# Altium project Q24_ECU_V1.PrjPcb (part 3 of 3)

## Sheet 5V_TO_3V_VD.SchDoc
size A4
Used 6 times, as channels 5 Volt Signal Bulkhead/Designator, 5 Volt Signal Bulkhead/Designator, 5 Volt Signal Bulkhead/Designator, 5 Volt Signal Bulkhead/Designator, 5 Volt Signal Bulkhead/Designator, 5 Volt Signal Bulkhead/Designator. Parts and nets are listed once, with the designators drawn on the sheet.
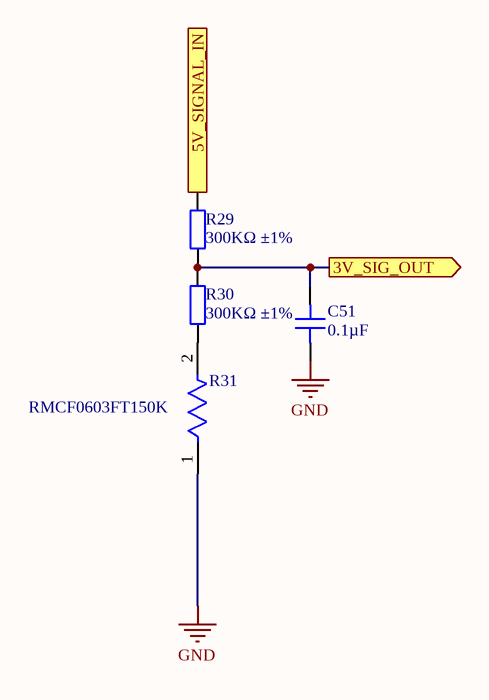
[diagram p20: 5V_TO_3V_VD.SchDoc]

### Parts
C51  0.1µF  [CAP 0402_1005]
R29  300KΩ ±1%  [0402_R]
R30  300KΩ ±1%  [0402_R]
R31  RMCF0603FT150K  [FP-RMCF0603-IPC_B]

### Ports
3V_SIG_OUT (out), 5V_SIGNAL_IN

### Nets
GND: C51.2 R31.1
3V_SIG_OUT: C51.1 R29.1 R30.2 ; port 3V_SIG_OUT
5V_SIGNAL_IN: R29.2 ; port 5V_SIGNAL_IN
NetR30_1: R30.1 R31.2

### Channels
5 Volt Signal Bulkhead/Designator: designators C51=C51_5_Volt_Signal_Bulkhead_Designator#1 R29=R29_5_Volt_Signal_Bulkhead_Designator#1 R30=R30_5_Volt_Signal_Bulkhead_Designator#1 R31=R31_Designator6; ports 3V_SIG_OUT=5-3_1 5V_SIGNAL_IN=Net4_1
5 Volt Signal Bulkhead/Designator: designators C51=C51_5_Volt_Signal_Bulkhead_Designator#2 R29=R29_5_Volt_Signal_Bulkhead_Designator#2 R30=R30_5_Volt_Signal_Bulkhead_Designator#2 R31=R31_Designator5; ports 3V_SIG_OUT=5-3_2 5V_SIGNAL_IN=Net4_2
5 Volt Signal Bulkhead/Designator: designators C51=C51_5_Volt_Signal_Bulkhead_Designator#3 R29=R29_5_Volt_Signal_Bulkhead_Designator#3 R30=R30_5_Volt_Signal_Bulkhead_Designator#3 R31=R31_Designator4; ports 3V_SIG_OUT=5-3_3 5V_SIGNAL_IN=Net4_3
5 Volt Signal Bulkhead/Designator: designators C51=C51_5_Volt_Signal_Bulkhead_Designator#4 R29=R29_5_Volt_Signal_Bulkhead_Designator#4 R30=R30_5_Volt_Signal_Bulkhead_Designator#4 R31=R31_Designator3; ports 3V_SIG_OUT=5-3_4 5V_SIGNAL_IN=Net4_4
5 Volt Signal Bulkhead/Designator: designators C51=C51_5_Volt_Signal_Bulkhead_Designator#5 R29=R29_5_Volt_Signal_Bulkhead_Designator#5 R30=R30_5_Volt_Signal_Bulkhead_Designator#5 R31=R31_Designator2; ports 3V_SIG_OUT=5-3_5 5V_SIGNAL_IN=Net4_5
5 Volt Signal Bulkhead/Designator: designators C51=C51_5_Volt_Signal_Bulkhead_Designator#6 R29=R29_5_Volt_Signal_Bulkhead_Designator#6 R30=R30_5_Volt_Signal_Bulkhead_Designator#6 R31=R31_Designator1; ports 3V_SIG_OUT=5-3_6 5V_SIGNAL_IN=Net4_6

### Library data of the parts
C51 = C0402C104K4RECAUTO: CAP CER 0402 0.1UF 16V X7R 10%; Manufacturer: KEMET; Part Number: C0402C104K4RECAUTO; Value: 0.1µF; Applications: Automotive, ESD Protection; Capacitance: 0.1µF; ComponentLink1Description: Datasheet; ComponentLink1URL: https://api.kemet.com/component-edge/download/datasheet/C0402C104K4RECAUTO.pdf; ComponentLink2Description: DigiKey Link; ComponentLink2URL: http://digikey.com/product-detail/en/kemet/C0402C104K4RECAUTO/399-17167-1-ND/8563708; Device Package: 0402 (1005 Metric); LastUpdated: 2020-09-02 1:02:25 AM; Lifecycle Status: Active; Minimum Order: 1; Mounting Type: Surface Mount, MLCC; Operating Temperature: -55°C ~ 125°C; Package / Case: 0402 (1005 Metric); Packaging: TapeAndReel; PartId: 1731; Part Status: Active; Price: 0.02; Series: ESD SMD Auto X7R; Size / Dimension: 0.039" L x 0.020" W (1.00mm x 0.50mm); Supplier 1: DigiKey; Supplier Part Number 1: 399-17167-1-ND; Temperature Coefficient: X7R; Thickness (Max): 0.022" (0.55mm); Tolerance: ±10%; Voltage - Rated: 16V; Ratings: AEC-Q200
R29 R30 = 0402 300K (3003) 1%: Chip resistor; Manufacturer: Uniroyal Elec; PartNumber: 0402WGF3003TCE; Power: 1/16W; ComponentLink1Description: Supplier link; ComponentLink1URL: http://www.szlcsc.com/product/details_26517.html; Package: 0402; Supplier: LC; SuppliersPartNumber: C25774; Resistance: 300KΩ; Tolerance: 1%
R31 = CMP-26527-003138-1: 150kΩ ±1% 0.1W 0603 Thick Film Chip Resistor AEC-Q200 compliant; Temperature Coefficient: 100ppm/°C; Max Power Dissipation: 100mW; Resistance: 150kR; Construction: Rectangular; Width: 0.031inch; Length: 0.061inch; Tolerance: 1%; Case Code (Metric): 1608; Radiation Hardening: No; Number of Terminations: 2; Case/Package: 0603; Max Operating Temperature: 155°C; Case Code (Imperial): 0603; Depth: 0.8mm; Features: Automotive AEC-Q200; RoHS Compliant: Yes; Packaging: Tape and Reel; Height: 0.022inch; Contact Plating: Tin; Series: RMCF; Military Standard: Not; Size Code: 0603; Mount: Surface Mount; Min Operating Temperature: -55°C; Power Rating: 100mW; Resistor Type: Thick Film; Lead Free: Lead Free

## Sheet Single_12V.SchDoc
size A4
Used 3 times, as channels Motor Controller 1, Motor Controller 2, Steering. Parts and nets are listed once, with the designators drawn on the sheet.
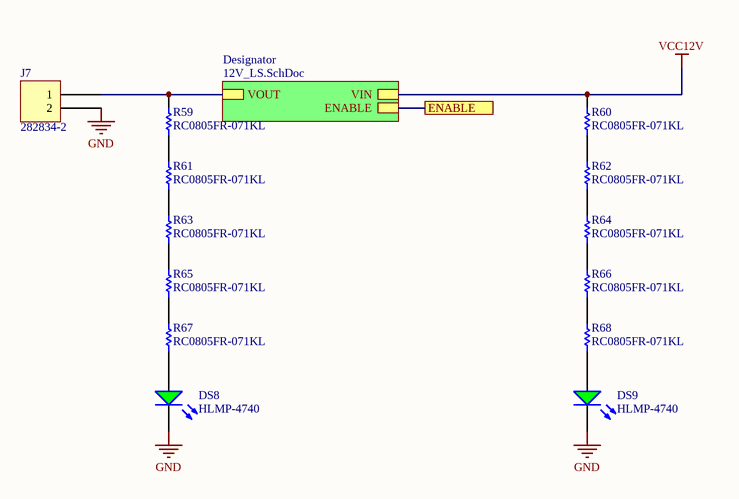
[diagram p21: Single_12V.SchDoc]

### Parts
DS8  HLMP-4740  [AVAG-HLMP-4740]
DS9  HLMP-4740  [AVAG-HLMP-4740]
J7  282834-2  [TE 282834-2]
R59  RC0805FR-071KL  [RESC2013X60X35ML10T20]
R60  RC0805FR-071KL  [RESC2013X60X35ML10T20]
R61  RC0805FR-071KL  [RESC2013X60X35ML10T20]
R62  RC0805FR-071KL  [RESC2013X60X35ML10T20]
R63  RC0805FR-071KL  [RESC2013X60X35ML10T20]
R64  RC0805FR-071KL  [RESC2013X60X35ML10T20]
R65  RC0805FR-071KL  [RESC2013X60X35ML10T20]
R66  RC0805FR-071KL  [RESC2013X60X35ML10T20]
R67  RC0805FR-071KL  [RESC2013X60X35ML10T20]
R68  RC0805FR-071KL  [RESC2013X60X35ML10T20]

### Sub-sheets
Designator = 12V_LS.SchDoc: VIN, VOUT, ENABLE

### Ports
ENABLE

### Nets
GND: DS8.2(K) DS9.2(K) J7.2
VCC12V: R60.2 ; sheet Designator/VIN
ENABLE: port ENABLE, sheet Designator/ENABLE
NetDS8_1: DS8.1(A) R67.1
NetDS9_1: DS9.1(A) R68.1
NetJ7_1: J7.1 R59.2 ; sheet Designator/VOUT
NetR59_1: R59.1 R61.2
NetR60_1: R60.1 R62.2
NetR61_1: R61.1 R63.2
NetR62_1: R62.1 R64.2
NetR63_1: R63.1 R65.2
NetR64_1: R64.1 R66.2
NetR65_1: R65.1 R67.2
NetR66_1: R66.1 R68.2

### Channels
Motor Controller 1: designators end in _Motor_Controller_1; ports ENABLE=MC1_ENABLE
Motor Controller 2: designators end in _Motor_Controller_2; ports ENABLE=MC2_ENABLE
Steering: designators end in _Steering; ports ENABLE=STEERING_ENABLE

### Library data of the parts
DS8 DS9 = CMP-2000-06413-1: T-1 3/4 (5 mm) Low Current LED Lamp, Green, 1.9 V, -20 to 100 degC, 2-Pin THD, RoHS, Bulk; Manufacturer: AvagoTechnologies; Type: Uni-Color; Peak Wavelength: 565nm; Rad Hard: No; Viewing Angle: 50°; Dominant Wavelength/Color Temperature: 569nm; Number of LEDs: 1; Lens Appearance: ColoredDiffused; Lens Shape Type: Circular; Mounting Orientation: TopMount; Intensity: 2.3mcd; Datasheet Version: 07/2014; Category: LEDs; Datasheet URL: http://docs.avagotech.com/docs/AV02-1557EN; Packaging: Bulk; Pin Count: 2; Mounting Technology: ThroughHole; Package Reference: HLMP-4740; Mounting: ThroughHole; Manufacturer URL: http://www.avagotech.com/; Color: Green; Package: 2T-13/4; Package Description: 2-Pin Through Hole Device, Dia 5.845 mm, Pitch 2.54 mm
J7 = 282834-2: TERM BLK 2P SIDE ENT 2.54MM PCB; Manufacturer: TE Connectivity AMP Connectors; Current: 10A; Mating Orientation: Horizontal with Board; Number of Levels: 1; Pitch: 0.100" (2.54mm); Positions Per Level: 2; Voltage: 150V; Wire Gauge: 16-30 AWG; Wire Termination: Screw - Rising Cage Clamp; Part Number: 282834-2; Color: Green; ComponentLink1Description: Datasheet; ComponentLink1URL: https://www.te.com/commerce/DocumentDelivery/DDEController?Action=srchrtrv&DocNm=282834&DocType=Customer+Drawing&DocLang=English; ComponentLink2Description: DigiKey Link; ComponentLink2URL: http://digikey.com/product-detail/en/te-connectivity-amp-connectors/282834-2/A98333-ND/1150135; LastUpdated: 2020-01-15 4:15:38 AM; Lifecycle Status: Active; Minimum Order: 1; Mounting Type: Through Hole; Packaging: Bulk; Part Status: Active; Price: 0.88; Series: Buchanan; Supplier 1: DigiKey; Supplier Part Number 1: A98333-ND
R59-R68 = CMP-2100-03671-1: Chip Resistor, 1 KOhm, +/- 1%, 125 mW, -55 to 155 degC, 0805 (2012 Metric), RoHS, Tape and Reel; Manufacturer: Yageo; Temperature Coefficient: 100ppm/degreesC; Voltage Rating (DC): 150V; Max Power Dissipation: 125mW; Resistance: 1KOhm; Number of Pins: 2; Number of Terminations: 2; Datasheet URL: http://www.yageo.com/NewPortal/yageodocoutput?fileName=/pdf/R-Chip/PYu-RC_Group_51_RoHS_L_5.pdf; Length: 0.079inch; Package Description: 2-Pin Surface Mounted Device, Body 2 x 1.25 mm; Depth: 1.25mm; Height: 0.024inch; Military Standard: Not; Case/Package: 0805; Package Reference: 0805; RoHSCompliant: true; Lead Free: LeadFree; Packaging: TapeandReel; Package Quantity: 1; Datasheet Version: Rev. 5, 10/2016; Tolerance: 1%; Min Operating Temperature: -55degC; Voltage Rating: 150V; Composition: ThickFilm; Case Code (Imperial): 0805; Power Rating: 125mW; Width: 0.049inch; Case Code (Metric): 2012; Manufacturer URL: http://www.yageo.com/; Max Operating Temperature: 155degC; REACH SVHC: Unknown; Termination: SMD/SMT

## Nets that join several sheets
GND: TOP (27 pins), STM32 (25 pins), Microcontroller/CAN1 (C39_CAN1.1 C40_CAN1.1 IC3_CAN1.2), Microcontroller/CAN2 (C39_CAN2.1 C40_CAN2.1 IC3_CAN2.2), IMU (6 pins), DebuggerMCU (19 pins), Power (7 pins), DebuggerConnectors (7 pins), 12V_POWER_BULKHEAD (6 pins), 12V Power And Ground/Shift Register (C18_Shift_Register2.2 U3_Shift_Register2.8 U3_Shift_Register2.13), 12V Power And Ground/Designator (5 pins), 12V Power And Ground/Designator (5 pins), 12V Power And Ground/Designator (5 pins), 12V Power And Ground/Designator (5 pins), 12V Power And Ground/Designator (5 pins), 12V Power And Ground/Designator (5 pins), boardPower (9 pins), Buck (14 pins), LDO (5 pins), 12 Volt Signal Bulkhead/ (C52_12_Volt_Signal_Bulkhead_#1.1 R33_12_Volt_Signal_Bulkhead_#1.1), 12 Volt Signal Bulkhead/ (C52_12_Volt_Signal_Bulkhead_#2.1 R33_12_Volt_Signal_Bulkhead_#2.1), 12 Volt Signal Bulkhead/ (C52_12_Volt_Signal_Bulkhead_#3.1 R33_12_Volt_Signal_Bulkhead_#3.1), 12 Volt Signal Bulkhead/ (C52_12_Volt_Signal_Bulkhead_#4.1 R33_12_Volt_Signal_Bulkhead_#4.1), 12 Volt Signal Bulkhead/ (C52_12_Volt_Signal_Bulkhead_#5.1 R33_12_Volt_Signal_Bulkhead_#5.1), 12 Volt Signal Bulkhead/ (C52_12_Volt_Signal_Bulkhead_#6.1 R33_12_Volt_Signal_Bulkhead_#6.1), 5VBulkhead (6 pins), 5V Power And Ground/Shift Register (C18_Shift_Register1.2 U3_Shift_Register1.8 U3_Shift_Register1.13), 5V Power And Ground/5VLS1 (C19_5VLS1.1 C20_5VLS1.1 IC1_5VLS1.4 R20_5VLS1.1), 5V Power And Ground/5VLS2 (C19_5VLS2.1 C20_5VLS2.1 IC1_5VLS2.4 R20_5VLS2.1), 5V Power And Ground/5VLS3 (C19_5VLS3.1 C20_5VLS3.1 IC1_5VLS3.4 R20_5VLS3.1), 5V Power And Ground/5VLS4 (C19_5VLS4.1 C20_5VLS4.1 IC1_5VLS4.4 R20_5VLS4.1), 5V Power And Ground/5VLS5 (C19_5VLS5.1 C20_5VLS5.1 IC1_5VLS5.4 R20_5VLS5.1), 5V Power And Ground/5VLS6 (C19_5VLS6.1 C20_5VLS6.1 IC1_5VLS6.4 R20_5VLS6.1), 5 Volt Signal Bulkhead/Designator (C51_5_Volt_Signal_Bulkhead_Designator#1.2 R31_Designator6.1), 5 Volt Signal Bulkhead/Designator (C51_5_Volt_Signal_Bulkhead_Designator#2.2 R31_Designator5.1), 5 Volt Signal Bulkhead/Designator (C51_5_Volt_Signal_Bulkhead_Designator#3.2 R31_Designator4.1), 5 Volt Signal Bulkhead/Designator (C51_5_Volt_Signal_Bulkhead_Designator#4.2 R31_Designator3.1), 5 Volt Signal Bulkhead/Designator (C51_5_Volt_Signal_Bulkhead_Designator#5.2 R31_Designator2.1), 5 Volt Signal Bulkhead/Designator (C51_5_Volt_Signal_Bulkhead_Designator#6.2 R31_Designator1.1), Motor Controller 1 (DS8_Motor_Controller_1.2 DS9_Motor_Controller_1.2 J7_Motor_Controller_1.2), Motor Controller 1/Designator (5 pins), Motor Controller 2 (DS8_Motor_Controller_2.2 DS9_Motor_Controller_2.2 J7_Motor_Controller_2.2), Motor Controller 2/Designator (5 pins), Steering (DS8_Steering.2 DS9_Steering.2 J7_Steering.2), Steering/Designator (5 pins)
USB_5V: Power (C15.2 C16.2 D3.A VR1.3), DebuggerConnectors (L2.2)
VCC3V3: STM32 (19 pins), Microcontroller/CAN1 (C39_CAN1.2 IC3_CAN1.5), Microcontroller/CAN2 (C39_CAN2.2 IC3_CAN2.5), IMU (5 pins), DebuggerMCU (6 pins), DebuggerConnectors (P4.2 R69.2), 12V Power And Ground/Designator (12_LOAD_SWITCH_12V_Power_And_Ground_Designator#1.3 C23_12V_Power_And_Ground_Designator#1.2 R21_Designator6.2), 12V Power And Ground/Designator (12_LOAD_SWITCH_12V_Power_And_Ground_Designator#2.3 C23_12V_Power_And_Ground_Designator#2.2 R21_Designator5.2), 12V Power And Ground/Designator (12_LOAD_SWITCH_12V_Power_And_Ground_Designator#3.3 C23_12V_Power_And_Ground_Designator#3.2 R21_Designator4.2), 12V Power And Ground/Designator (12_LOAD_SWITCH_12V_Power_And_Ground_Designator#4.3 C23_12V_Power_And_Ground_Designator#4.2 R21_Designator3.2), 12V Power And Ground/Designator (12_LOAD_SWITCH_12V_Power_And_Ground_Designator#5.3 C23_12V_Power_And_Ground_Designator#5.2 R21_Designator2.2), 12V Power And Ground/Designator (12_LOAD_SWITCH_12V_Power_And_Ground_Designator#6.3 C23_12V_Power_And_Ground_Designator#6.2 R21_Designator1.2), boardPower (R45.2), LDO (C35.1 C38.2 VR2.2), 5V Power And Ground/5VLS1 (R19_5VLS1.2), 5V Power And Ground/5VLS2 (R19_5VLS2.2), 5V Power And Ground/5VLS3 (R19_5VLS3.2), 5V Power And Ground/5VLS4 (R19_5VLS4.2), 5V Power And Ground/5VLS5 (R19_5VLS5.2), 5V Power And Ground/5VLS6 (R19_5VLS6.2), Motor Controller 1/Designator (12_LOAD_SWITCH_Motor_Controller_1_Designator.3 C23_Motor_Controller_1_Designator.2 R21_Designator7.2), Motor Controller 2/Designator (12_LOAD_SWITCH_Motor_Controller_2_Designator.3 C23_Motor_Controller_2_Designator.2 R21_Designator8.2), Steering/Designator (12_LOAD_SWITCH_Steering_Designator.3 C23_Steering_Designator.2 R21_Designator9.2)
VCC3V3DEBUG: DebuggerMCU (7 pins), Power (C14.1 C17.2 D4.A VR1.2)
VCC5V: Microcontroller/CAN1 (C40_CAN1.2 IC3_CAN1.3), Microcontroller/CAN2 (C40_CAN2.2 IC3_CAN2.3), 12V Power And Ground/Shift Register (C18_Shift_Register2.1 U3_Shift_Register2.10 U3_Shift_Register2.16), boardPower (R44.2), Buck (6 pins), LDO (C36.2 C37.2 VR2.3), 5V Power And Ground/Shift Register (C18_Shift_Register1.1 U3_Shift_Register1.10 U3_Shift_Register1.16), 5V Power And Ground/5VLS1 (C19_5VLS1.2 IC1_5VLS1.1 IC1_5VLS1.2), 5V Power And Ground/5VLS2 (C19_5VLS2.2 IC1_5VLS2.1 IC1_5VLS2.2), 5V Power And Ground/5VLS3 (C19_5VLS3.2 IC1_5VLS3.1 IC1_5VLS3.2), 5V Power And Ground/5VLS4 (C19_5VLS4.2 IC1_5VLS4.1 IC1_5VLS4.2), 5V Power And Ground/5VLS5 (C19_5VLS5.2 IC1_5VLS5.1 IC1_5VLS5.2), 5V Power And Ground/5VLS6 (C19_5VLS6.2 IC1_5VLS6.1 IC1_5VLS6.2)
VCC12V: 12V Power And Ground/Designator (12_LOAD_SWITCH_12V_Power_And_Ground_Designator#1.1 C21_12V_Power_And_Ground_Designator#1.1), 12V Power And Ground/Designator (12_LOAD_SWITCH_12V_Power_And_Ground_Designator#2.1 C21_12V_Power_And_Ground_Designator#2.1), 12V Power And Ground/Designator (12_LOAD_SWITCH_12V_Power_And_Ground_Designator#3.1 C21_12V_Power_And_Ground_Designator#3.1), 12V Power And Ground/Designator (12_LOAD_SWITCH_12V_Power_And_Ground_Designator#4.1 C21_12V_Power_And_Ground_Designator#4.1), 12V Power And Ground/Designator (12_LOAD_SWITCH_12V_Power_And_Ground_Designator#5.1 C21_12V_Power_And_Ground_Designator#5.1), 12V Power And Ground/Designator (12_LOAD_SWITCH_12V_Power_And_Ground_Designator#6.1 C21_12V_Power_And_Ground_Designator#6.1), boardPower (7 pins), Buck (5 pins), 5VBulkhead (R18.2), Motor Controller 1 (R60_Motor_Controller_1.2), Motor Controller 1/Designator (12_LOAD_SWITCH_Motor_Controller_1_Designator.1 C21_Motor_Controller_1_Designator.1), Motor Controller 2 (R60_Motor_Controller_2.2), Motor Controller 2/Designator (12_LOAD_SWITCH_Motor_Controller_2_Designator.1 C21_Motor_Controller_2_Designator.1), Steering (R60_Steering.2), Steering/Designator (12_LOAD_SWITCH_Steering_Designator.1 C21_Steering_Designator.1)
5-3_1: STM32 (U1.29), 5 Volt Signal Bulkhead/Designator (C51_5_Volt_Signal_Bulkhead_Designator#1.1 R29_5_Volt_Signal_Bulkhead_Designator#1.1 R30_5_Volt_Signal_Bulkhead_Designator#1.2)
5-3_2: STM32 (U1.30), 5 Volt Signal Bulkhead/Designator (C51_5_Volt_Signal_Bulkhead_Designator#2.1 R29_5_Volt_Signal_Bulkhead_Designator#2.1 R30_5_Volt_Signal_Bulkhead_Designator#2.2)
5-3_3: STM32 (U1.31), 5 Volt Signal Bulkhead/Designator (C51_5_Volt_Signal_Bulkhead_Designator#3.1 R29_5_Volt_Signal_Bulkhead_Designator#3.1 R30_5_Volt_Signal_Bulkhead_Designator#3.2)
5-3_4: STM32 (U1.32), 5 Volt Signal Bulkhead/Designator (C51_5_Volt_Signal_Bulkhead_Designator#4.1 R29_5_Volt_Signal_Bulkhead_Designator#4.1 R30_5_Volt_Signal_Bulkhead_Designator#4.2)
5-3_5: STM32 (U1.33), 5 Volt Signal Bulkhead/Designator (C51_5_Volt_Signal_Bulkhead_Designator#5.1 R29_5_Volt_Signal_Bulkhead_Designator#5.1 R30_5_Volt_Signal_Bulkhead_Designator#5.2)
5-3_6: STM32 (U1.34), 5 Volt Signal Bulkhead/Designator (C51_5_Volt_Signal_Bulkhead_Designator#6.1 R29_5_Volt_Signal_Bulkhead_Designator#6.1 R30_5_Volt_Signal_Bulkhead_Designator#6.2)
5V_CLOCK: STM32 (U1.1), 5V Power And Ground/Shift Register (U3_Shift_Register1.11)
5V_DATA: STM32 (U1.5), 5V Power And Ground/Shift Register (U3_Shift_Register1.14)
5V_FAULT: STM32 (U1.80), 5VBulkhead (R18.1), 5V Power And Ground/5VLS1 (IC1_5VLS1.8), 5V Power And Ground/5VLS2 (IC1_5VLS2.8), 5V Power And Ground/5VLS3 (IC1_5VLS3.8), 5V Power And Ground/5VLS4 (IC1_5VLS4.8), 5V Power And Ground/5VLS5 (IC1_5VLS5.8), 5V Power And Ground/5VLS6 (IC1_5VLS6.8)
5V_LATCH: STM32 (U1.3), 5V Power And Ground/Shift Register (U3_Shift_Register1.12)
12-3_1: STM32 (U1.15), 12 Volt Signal Bulkhead/ (C52_12_Volt_Signal_Bulkhead_#1.2 R32_12_Volt_Signal_Bulkhead_#1.1 R33_12_Volt_Signal_Bulkhead_#1.2)
12-3_2: STM32 (U1.16), 12 Volt Signal Bulkhead/ (C52_12_Volt_Signal_Bulkhead_#2.2 R32_12_Volt_Signal_Bulkhead_#2.1 R33_12_Volt_Signal_Bulkhead_#2.2)
12-3_3: STM32 (U1.36), 12 Volt Signal Bulkhead/ (C52_12_Volt_Signal_Bulkhead_#3.2 R32_12_Volt_Signal_Bulkhead_#3.1 R33_12_Volt_Signal_Bulkhead_#3.2)
12-3_4: STM32 (U1.18), 12 Volt Signal Bulkhead/ (C52_12_Volt_Signal_Bulkhead_#4.2 R32_12_Volt_Signal_Bulkhead_#4.1 R33_12_Volt_Signal_Bulkhead_#4.2)
12-3_5: STM32 (U1.26), 12 Volt Signal Bulkhead/ (C52_12_Volt_Signal_Bulkhead_#5.2 R32_12_Volt_Signal_Bulkhead_#5.1 R33_12_Volt_Signal_Bulkhead_#5.2)
12-3_6: STM32 (U1.25), 12 Volt Signal Bulkhead/ (C52_12_Volt_Signal_Bulkhead_#6.2 R32_12_Volt_Signal_Bulkhead_#6.1 R33_12_Volt_Signal_Bulkhead_#6.2)
12V_CLOCK: STM32 (U1.78), 12V Power And Ground/Shift Register (U3_Shift_Register2.11)
12V_DATA: STM32 (U1.35), 12V Power And Ground/Shift Register (U3_Shift_Register2.14)
12V_LATCH: STM32 (U1.77), 12V Power And Ground/Shift Register (U3_Shift_Register2.12)
AC_CS: STM32 (U1.82), IMU (U5.5)
AC_INT: STM32 (U1.79), IMU (U5.6)
AC_SCL: STM32 (U1.84), IMU (U5.2)
AC_SDI: STM32 (U1.54), IMU (U5.3)
AC_SDO: STM32 (U1.17), IMU (U5.4)
CAN1_N: Microcontroller/CAN1 (IC3_CAN1.6 IC3_CAN1.7 R28_CAN1.1 S2_CAN1.1), Microcontroller/CAN2 (IC3_CAN2.6 IC3_CAN2.7 R28_CAN2.1 S2_CAN2.1), Connectors (J3.1 J3.2 J4.1 J4.2)
CAN1_RX: STM32 (U1.70), Microcontroller/CAN1 (IC3_CAN1.4)
CAN1_STBY: STM32 (U1.69), Microcontroller/CAN1 (IC3_CAN1.8)
CAN1_TX: STM32 (U1.71), Microcontroller/CAN1 (IC3_CAN1.1)
CAN2_RX: STM32 (U1.51), Microcontroller/CAN2 (IC3_CAN2.4)
CAN2_STBY: STM32 (U1.53), Microcontroller/CAN2 (IC3_CAN2.8)
CAN2_TX: STM32 (U1.52), Microcontroller/CAN2 (IC3_CAN2.1)
MC1_ENABLE: STM32 (U1.44), Motor Controller 1/Designator (12_LOAD_SWITCH_Motor_Controller_1_Designator.2)
MC2_ENABLE: STM32 (U1.45), Motor Controller 2/Designator (12_LOAD_SWITCH_Motor_Controller_2_Designator.2)
Net3_1: 12V_SIGNAL_BULKHEAD (3.1), 12 Volt Signal Bulkhead/ (R32_12_Volt_Signal_Bulkhead_#1.2)
Net3_2: 12V_SIGNAL_BULKHEAD (3.2), 12 Volt Signal Bulkhead/ (R32_12_Volt_Signal_Bulkhead_#2.2)
Net3_3: 12V_SIGNAL_BULKHEAD (3.3), 12 Volt Signal Bulkhead/ (R32_12_Volt_Signal_Bulkhead_#3.2)
Net3_4: 12V_SIGNAL_BULKHEAD (3.4), 12 Volt Signal Bulkhead/ (R32_12_Volt_Signal_Bulkhead_#4.2)
Net3_5: 12V_SIGNAL_BULKHEAD (3.5), 12 Volt Signal Bulkhead/ (R32_12_Volt_Signal_Bulkhead_#5.2)
Net3_6: 12V_SIGNAL_BULKHEAD (3.6), 12 Volt Signal Bulkhead/ (R32_12_Volt_Signal_Bulkhead_#6.2)
Net4_1: 5V_SIGNAL_BULKHEAD (4.1), 5 Volt Signal Bulkhead/Designator (R29_5_Volt_Signal_Bulkhead_Designator#1.2)
Net4_2: 5V_SIGNAL_BULKHEAD (4.2), 5 Volt Signal Bulkhead/Designator (R29_5_Volt_Signal_Bulkhead_Designator#2.2)
Net4_3: 5V_SIGNAL_BULKHEAD (4.3), 5 Volt Signal Bulkhead/Designator (R29_5_Volt_Signal_Bulkhead_Designator#3.2)
Net4_4: 5V_SIGNAL_BULKHEAD (4.4), 5 Volt Signal Bulkhead/Designator (R29_5_Volt_Signal_Bulkhead_Designator#4.2)
Net4_5: 5V_SIGNAL_BULKHEAD (4.5), 5 Volt Signal Bulkhead/Designator (R29_5_Volt_Signal_Bulkhead_Designator#5.2)
Net4_6: 5V_SIGNAL_BULKHEAD (4.6), 5 Volt Signal Bulkhead/Designator (R29_5_Volt_Signal_Bulkhead_Designator#6.2)
Net12_LOAD_SWITCH_12V_Power_And_Ground_Designator#1_2: 12V Power And Ground/Shift Register (U3_Shift_Register2.15), 12V Power And Ground/Designator (12_LOAD_SWITCH_12V_Power_And_Ground_Designator#1.2)
Net12_LOAD_SWITCH_12V_Power_And_Ground_Designator#1_7: 12V_POWER_BULKHEAD (J2.1), 12V Power And Ground/Designator (12_LOAD_SWITCH_12V_Power_And_Ground_Designator#1.7 12_LOAD_SWITCH_12V_Power_And_Ground_Designator#1.8 C22_Designator6.1 R22_Designator6.1)
Net12_LOAD_SWITCH_12V_Power_And_Ground_Designator#2_2: 12V Power And Ground/Shift Register (U3_Shift_Register2.1), 12V Power And Ground/Designator (12_LOAD_SWITCH_12V_Power_And_Ground_Designator#2.2)
Net12_LOAD_SWITCH_12V_Power_And_Ground_Designator#2_7: 12V_POWER_BULKHEAD (J2.2), 12V Power And Ground/Designator (12_LOAD_SWITCH_12V_Power_And_Ground_Designator#2.7 12_LOAD_SWITCH_12V_Power_And_Ground_Designator#2.8 C22_Designator5.1 R22_Designator5.1)
Net12_LOAD_SWITCH_12V_Power_And_Ground_Designator#3_2: 12V Power And Ground/Shift Register (U3_Shift_Register2.2), 12V Power And Ground/Designator (12_LOAD_SWITCH_12V_Power_And_Ground_Designator#3.2)
Net12_LOAD_SWITCH_12V_Power_And_Ground_Designator#3_7: 12V_POWER_BULKHEAD (J2.3), 12V Power And Ground/Designator (12_LOAD_SWITCH_12V_Power_And_Ground_Designator#3.7 12_LOAD_SWITCH_12V_Power_And_Ground_Designator#3.8 C22_Designator4.1 R22_Designator4.1)
Net12_LOAD_SWITCH_12V_Power_And_Ground_Designator#4_2: 12V Power And Ground/Shift Register (U3_Shift_Register2.3), 12V Power And Ground/Designator (12_LOAD_SWITCH_12V_Power_And_Ground_Designator#4.2)
Net12_LOAD_SWITCH_12V_Power_And_Ground_Designator#4_7: 12V_POWER_BULKHEAD (J2.4), 12V Power And Ground/Designator (12_LOAD_SWITCH_12V_Power_And_Ground_Designator#4.7 12_LOAD_SWITCH_12V_Power_And_Ground_Designator#4.8 C22_Designator3.1 R22_Designator3.1)
Net12_LOAD_SWITCH_12V_Power_And_Ground_Designator#5_2: 12V Power And Ground/Shift Register (U3_Shift_Register2.4), 12V Power And Ground/Designator (12_LOAD_SWITCH_12V_Power_And_Ground_Designator#5.2)
Net12_LOAD_SWITCH_12V_Power_And_Ground_Designator#5_7: 12V_POWER_BULKHEAD (J2.5), 12V Power And Ground/Designator (12_LOAD_SWITCH_12V_Power_And_Ground_Designator#5.7 12_LOAD_SWITCH_12V_Power_And_Ground_Designator#5.8 C22_Designator2.1 R22_Designator2.1)
Net12_LOAD_SWITCH_12V_Power_And_Ground_Designator#6_2: 12V Power And Ground/Shift Register (U3_Shift_Register2.5), 12V Power And Ground/Designator (12_LOAD_SWITCH_12V_Power_And_Ground_Designator#6.2)
Net12_LOAD_SWITCH_12V_Power_And_Ground_Designator#6_7: 12V_POWER_BULKHEAD (J2.6), 12V Power And Ground/Designator (12_LOAD_SWITCH_12V_Power_And_Ground_Designator#6.7 12_LOAD_SWITCH_12V_Power_And_Ground_Designator#6.8 C22_Designator1.1 R22_Designator1.1)
Net12_LOAD_SWITCH_Motor_Controller_1_Designator_7: Motor Controller 1 (J7_Motor_Controller_1.1 R59_Motor_Controller_1.2), Motor Controller 1/Designator (12_LOAD_SWITCH_Motor_Controller_1_Designator.7 12_LOAD_SWITCH_Motor_Controller_1_Designator.8 C22_Designator7.1 R22_Designator7.1)
Net12_LOAD_SWITCH_Motor_Controller_2_Designator_7: Motor Controller 2 (J7_Motor_Controller_2.1 R59_Motor_Controller_2.2), Motor Controller 2/Designator (12_LOAD_SWITCH_Motor_Controller_2_Designator.7 12_LOAD_SWITCH_Motor_Controller_2_Designator.8 C22_Designator8.1 R22_Designator8.1)
Net12_LOAD_SWITCH_Steering_Designator_7: Steering (J7_Steering.1 R59_Steering.2), Steering/Designator (12_LOAD_SWITCH_Steering_Designator.7 12_LOAD_SWITCH_Steering_Designator.8 C22_Designator9.1 R22_Designator9.1)
NetC20_5VLS1_2: 5VBulkhead (J1.1), 5V Power And Ground/5VLS1 (C20_5VLS1.2 IC1_5VLS1.6 IC1_5VLS1.7)
NetC20_5VLS2_2: 5VBulkhead (J1.2), 5V Power And Ground/5VLS2 (C20_5VLS2.2 IC1_5VLS2.6 IC1_5VLS2.7)
NetC20_5VLS3_2: 5VBulkhead (J1.3), 5V Power And Ground/5VLS3 (C20_5VLS3.2 IC1_5VLS3.6 IC1_5VLS3.7)
NetC20_5VLS4_2: 5VBulkhead (J1.4), 5V Power And Ground/5VLS4 (C20_5VLS4.2 IC1_5VLS4.6 IC1_5VLS4.7)
NetC20_5VLS5_2: 5VBulkhead (J1.5), 5V Power And Ground/5VLS5 (C20_5VLS5.2 IC1_5VLS5.6 IC1_5VLS5.7)
NetC20_5VLS6_2: 5VBulkhead (J1.6), 5V Power And Ground/5VLS6 (C20_5VLS6.2 IC1_5VLS6.6 IC1_5VLS6.7)
NetIC1_5VLS1_3: 5V Power And Ground/Shift Register (U3_Shift_Register1.15), 5V Power And Ground/5VLS1 (IC1_5VLS1.3 R19_5VLS1.1)
NetIC1_5VLS2_3: 5V Power And Ground/Shift Register (U3_Shift_Register1.1), 5V Power And Ground/5VLS2 (IC1_5VLS2.3 R19_5VLS2.1)
NetIC1_5VLS3_3: 5V Power And Ground/Shift Register (U3_Shift_Register1.2), 5V Power And Ground/5VLS3 (IC1_5VLS3.3 R19_5VLS3.1)
NetIC1_5VLS4_3: 5V Power And Ground/Shift Register (U3_Shift_Register1.3), 5V Power And Ground/5VLS4 (IC1_5VLS4.3 R19_5VLS4.1)
NetIC1_5VLS5_3: 5V Power And Ground/Shift Register (U3_Shift_Register1.4), 5V Power And Ground/5VLS5 (IC1_5VLS5.3 R19_5VLS5.1)
NetIC1_5VLS6_3: 5V Power And Ground/Shift Register (U3_Shift_Register1.5), 5V Power And Ground/5VLS6 (IC1_5VLS6.3 R19_5VLS6.1)
NetJ8_1: TOP (J8.1), STM32 (U1.86)
NetJ8_2: TOP (J8.2), STM32 (U1.87)
NetJ9_1: TOP (J9.1), STM32 (U1.23)
NetJ9_2: TOP (J9.2), STM32 (U1.24)
NetP1_1: TOP (P1.1), STM32 (U1.38)
NetP1_2: TOP (P1.2), STM32 (U1.39)
NetP1_3: TOP (P1.3), STM32 (U1.65)
NetP1_4: TOP (P1.4), STM32 (U1.66)
NetR1_2: TOP (R1.2 STLINK-HEADER-1.2), STM32 (U1.72)
NetR2_2: TOP (R2.2 STLINK-HEADER-1.1), STM32 (U1.76)
NetR3_2: TOP (R3.2), STM32 (U1.93)
NetR4_2: TOP (R4.2), STM32 (U1.92)
ST_JTCK: DebuggerMCU (U2.37), DebuggerConnectors (P4.4)
ST_JTMS: DebuggerMCU (U2.34), DebuggerConnectors (P4.3)
STEERING_ENABLE: STM32 (U1.46), Steering/Designator (12_LOAD_SWITCH_Steering_Designator.2)
T_JTCK: TOP (R2.1), DebuggerMCU (U2.26)
T_JTMS: TOP (R1.1), DebuggerMCU (R10.2 U2.27)
UART_RX: TOP (R4.1), DebuggerMCU (U2.13)
UART_TX: TOP (R3.1), DebuggerMCU (U2.12)
USB_D_N: DebuggerMCU (U2.32), DebuggerConnectors (J10.2)
USB_D_P: DebuggerMCU (U2.33), DebuggerConnectors (J10.3 R69.1)